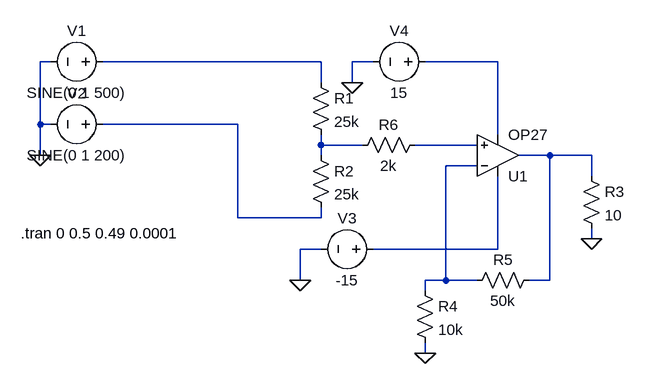
[diagram p0: schematic tubiness.asc]
tubiness.asc, the LTspice schematic file:
Version 4
SHEET 1 1000 680
WIRE -160 0 -176 0
WIRE 256 0 -80 0
WIRE 336 0 304 0
WIRE 528 0 416 0
WIRE 256 32 256 0
WIRE 304 32 304 0
WIRE -176 96 -176 0
WIRE -160 96 -176 96
WIRE 128 96 -80 96
WIRE 528 112 528 0
WIRE 256 128 256 112
WIRE 320 128 256 128
WIRE 496 128 400 128
WIRE -176 144 -176 96
WIRE 256 144 256 128
WIRE 608 144 560 144
WIRE 672 144 608 144
WIRE 496 160 448 160
WIRE 672 176 672 144
WIRE 128 240 128 96
WIRE 256 240 256 224
WIRE 256 240 128 240
WIRE 672 272 672 256
WIRE 256 288 224 288
WIRE 528 288 528 176
WIRE 528 288 336 288
WIRE 224 336 224 288
WIRE 448 336 448 160
WIRE 448 336 416 336
WIRE 496 336 448 336
WIRE 608 336 608 144
WIRE 608 336 576 336
WIRE 416 352 416 336
WIRE 416 448 416 432
FLAG 672 272 0
FLAG -176 144 0
FLAG 416 448 0
FLAG 304 32 0
FLAG 224 336 0
SYMBOL voltage -64 0 R90
WINDOW 0 -32 56 VBottom 2
WINDOW 3 32 56 VTop 2
WINDOW 123 0 0 Left 2
WINDOW 39 0 0 Left 2
SYMATTR InstName V1
SYMATTR Value SINE(0 1 500)
SYMBOL voltage -64 96 R90
WINDOW 0 -32 56 VBottom 2
WINDOW 3 32 56 VTop 2
WINDOW 123 0 0 Left 2
WINDOW 39 0 0 Left 2
SYMATTR InstName V2
SYMATTR Value SINE(0 1 200)
SYMBOL res 240 16 R0
SYMATTR InstName R1
SYMATTR Value 25k
SYMBOL res 240 128 R0
SYMATTR InstName R2
SYMATTR Value 25k
SYMBOL res 656 160 R0
SYMATTR InstName R3
SYMATTR Value 10
SYMBOL Opamps\\OP27 528 208 M180
SYMATTR InstName U1
SYMBOL res 400 336 R0
SYMATTR InstName R4
SYMATTR Value 10k
SYMBOL res 592 320 R90
WINDOW 0 0 56 VBottom 2
WINDOW 3 32 56 VTop 2
SYMATTR InstName R5
SYMATTR Value 50k
SYMBOL voltage 352 288 R90
WINDOW 0 -32 56 VBottom 2
WINDOW 3 32 56 VTop 2
WINDOW 123 0 0 Left 2
WINDOW 39 0 0 Left 2
SYMATTR InstName V3
SYMATTR Value -15
SYMBOL voltage 432 0 R90
WINDOW 0 -32 56 VBottom 2
WINDOW 3 32 56 VTop 2
WINDOW 123 0 0 Left 2
WINDOW 39 0 0 Left 2
SYMATTR InstName V4
SYMATTR Value 15
SYMBOL res 416 112 R90
WINDOW 0 0 56 VBottom 2
WINDOW 3 32 56 VTop 2
SYMATTR InstName R6
SYMATTR Value 2k
TEXT -206 264 Left 2 !.tran 0 0.5 0.49 0.0001

The netlist it stands for:
* tubiness.asc
V1 N001 0 SINE(0 1 500)
V2 N003 0 SINE(0 1 200)
R1 N001 N004 25k
R2 N004 N003 25k
R3 N006 0 10
XU1 N005 N007 N008 N002 N006 OP27  ; pins In+ In- V+ V- OUT
R4 N007 0 10k
R5 N006 N007 50k
V3 N008 0 -15
V4 N002 0 15
R6 N005 N004 2k
.tran 0 0.5 0.49 0.0001
.lib ADI.lib
.backanno
.end